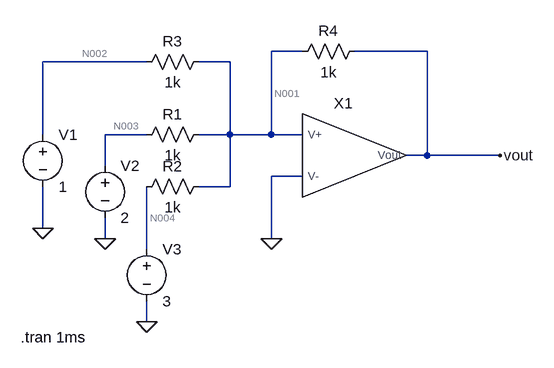
[diagram p0: schematic Summing_Amplifier.asc]
Summing_Amplifier.asc, the LTspice schematic file:
Version 4
SHEET 1 932 680
WIRE 176 32 128 32
WIRE 368 32 256 32
WIRE -64 48 -224 48
WIRE 64 48 16 48
WIRE -224 160 -224 48
WIRE -64 160 -128 160
WIRE 64 160 64 48
WIRE 64 160 16 160
WIRE 128 160 128 32
WIRE 128 160 64 160
WIRE 176 160 128 160
WIRE 368 192 368 32
WIRE 368 192 336 192
WIRE 480 192 368 192
WIRE -128 208 -128 160
WIRE 176 224 128 224
WIRE 64 240 64 160
WIRE 64 240 16 240
WIRE -224 304 -224 240
WIRE -128 320 -128 288
WIRE 128 320 128 224
WIRE -64 336 -64 240
WIRE -64 448 -64 416
FLAG 480 192 vout
FLAG 128 320 0
FLAG -224 304 0
FLAG -128 320 0
FLAG -64 448 0
SYMBOL MY_IDEAL_opamp 240 192 R0
SYMATTR InstName X1
SYMBOL res 32 144 R90
WINDOW 0 0 56 VBottom 2
WINDOW 3 32 56 VTop 2
SYMATTR InstName R1
SYMATTR Value 1k
SYMBOL res 32 224 R90
WINDOW 0 0 56 VBottom 2
WINDOW 3 32 56 VTop 2
SYMATTR InstName R2
SYMATTR Value 1k
SYMBOL res 32 32 R90
WINDOW 0 0 56 VBottom 2
WINDOW 3 32 56 VTop 2
SYMATTR InstName R3
SYMATTR Value 1k
SYMBOL res 272 16 R90
WINDOW 0 0 56 VBottom 2
WINDOW 3 32 56 VTop 2
SYMATTR InstName R4
SYMATTR Value 1k
SYMBOL voltage -224 144 R0
WINDOW 123 0 0 Left 0
WINDOW 39 0 0 Left 0
SYMATTR InstName V1
SYMATTR Value 1
SYMBOL voltage -128 192 R0
WINDOW 123 0 0 Left 0
WINDOW 39 0 0 Left 0
SYMATTR InstName V2
SYMATTR Value 2
SYMBOL voltage -64 320 R0
WINDOW 123 0 0 Left 0
WINDOW 39 0 0 Left 0
SYMATTR InstName V3
SYMATTR Value 3
TEXT -258 472 Left 2 !.tran 1ms

The netlist it stands for:
* Summing_Amplifier.asc
XX1 N001 0 vout MY_IDEAL_opamp  ; pins V+ V- Vout
R1 N001 N003 1k
R2 N001 N004 1k
R3 N001 N002 1k
R4 vout N001 1k
V1 N002 0 1
V2 N003 0 2
V3 N004 0 3
.tran 1ms
.backanno
.end

* Results of the author's LTspice run, read from the files saved beside the schematic
* Operating Point, zero values left out:
*   V(vout) = -6 V
*   V(n001) = 600 nV
*   V(n003) = 2 V
*   V(n004) = 3 V
*   V(n002) = 1 V
*   I(R4) = -6 mA
*   I(R3) = -1 mA
*   I(R2) = -3 mA
*   I(R1) = -2 mA
*   I(V3) = -3 mA
*   I(V2) = -2 mA
*   I(V1) = -1 mA
*   Ix(x1:VOUT) = 6 mA